# EAGLE design template (EAGLE 8.5.0)
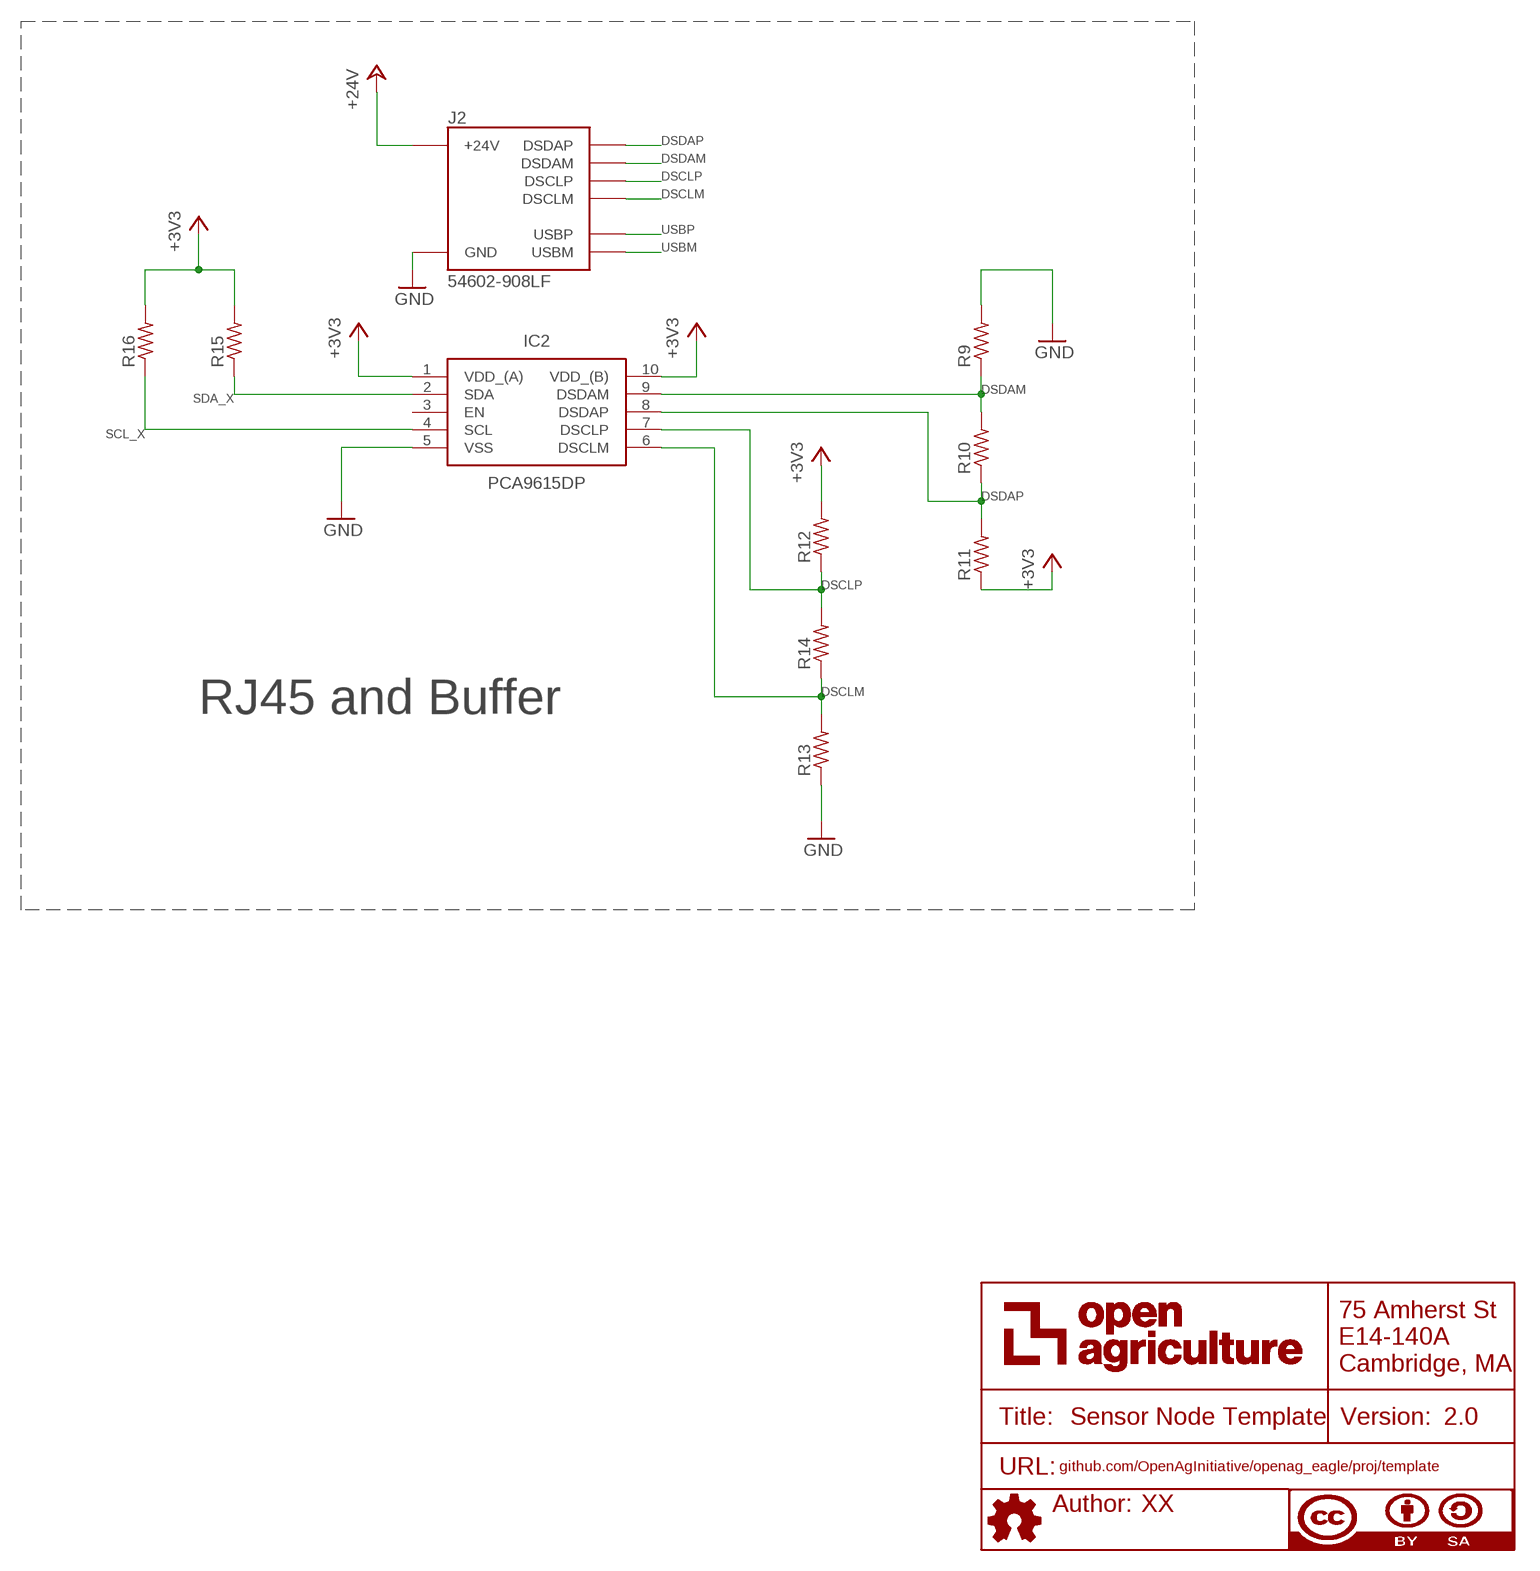
[diagram p0: schematic, sheet 1]

## Parts
FRAME1  DOCFIELD  [DOCFIELD]
IC2  PCA9615DP  [SOP50P490X110-10N]
J2  54602-908LF  OPENAG-V1-RJ45PTH  [OPENAG-V1-RJ45]
R9  R-US_R0603  [R0603]
R10  R-US_R0603  [R0603]
R11  R-US_R0603  [R0603]
R12  R-US_R0603  [R0603]
R13  R-US_R0603  [R0603]
R14  R-US_R0603  [R0603]
R15  R-US_R0603  [R0603]
R16  R-US_R0603  [R0603]

## Nets
+3V3: IC2.1(VDD_(A)) IC2.10(VDD_(B)) R11.1 R12.2 R15.2 R16.2
+24V: J2.24V(6)(+24V)
DSCLM: IC2.6(DSCLM) J2.DSCLM(5)(DSCLM) R13.2 R14.1
DSCLP: IC2.7(DSCLP) J2.DSCLP(4)(DSCLP) R12.1 R14.2
DSDAM: IC2.9(DSDAM) J2.DSDAM(2)(DSDAM) R9.1 R10.2
DSDAP: IC2.8(DSDAP) J2.DSDAP(1)(DSDAP) R10.1 R11.2
GND: IC2.5(VSS) J2.GND(3)(GND) R9.2 R13.1
SCL_X: IC2.4(SCL) R16.1
SDA_X: IC2.2(SDA) R15.1
USBM: J2.USBM(8)(USBM)
USBP: J2.USBP(7)(USBP)
Unconnected: IC2.3(EN)

## Notes on the sheet
- RJ45 and Buffer

## Library data of the parts
FRAME1 = openag-frames:DOCFIELD: DOCUMENT FIELD; AUTHOR: XX; DESCRIPTION: Sensor Node Template; TITLE: Sensor Node Template; URL: github.com/OpenAgInitiative/openag_eagle/proj/template; VER: 2.0
IC2 = PCA9615DP:PCA9615DP: Buffer, ReDriver 2 Channel 400kHz 10-TSSOP Source: Datasheet <http://www.nxp.com/docs/en/data-sheet/PCA9615.pdf>; DESCRIPTION: Buffer, ReDriver 2 Channel 400kHz 10-TSSOP; HEIGHT: 1.1mm; MANUFACTURER_NAME: Nexperia; MANUFACTURER_PART_NUMBER: PCA9615DP; SUPPLIER_NAME: RS
J2 = openag_connector:OPENAG-V1-RJ45: Amphenol FCI - 54602-908LF - CONN MOD JACK 8P8C R/A UNSHLD Description: Jack Modular Connector 8p8c (RJ45, Ethernet) 90� Angle (Right) Unshielded Cat3 Technical Specifications: Connector Type: Jack Number of Positions/Contacts: 8p8c (RJ45, Ethernet) Number of Ports: 1 Number of Rows: 1 Mounting Type: Through Hole Orientation: 90� Angle (Right) Termination: Solder Shielding: Unshielded Ratings: Cat3 Features: Board Lock LED Color: Does Not Contain LED Tab Direction: Down Contact Material: Copper Alloy Contact Finish: Gold Contact Finish Thickness: 15�in (0.38�m) Housing Material: Polyester, Glass Filled Operating Temperature: -40�C ~ 70�C Datasheet(s): 54601-x04(zzz)WPLF Drawing <http://cdn.amphenol-icc.com/media/wysiwyg/files/drawing/c-bmj-0102.pdf> Vendor(s): Digikey: 609-1046-ND <https://www.digikey.com/product-detail/en/amphenol-fci/54602-908LF/609-1046-ND/1001360>; POPULATE: YES; VERIFIED: NO
R9-R16 = rcl:R-US_: RESISTOR, American symbol; SPICEPREFIX: R

## Board
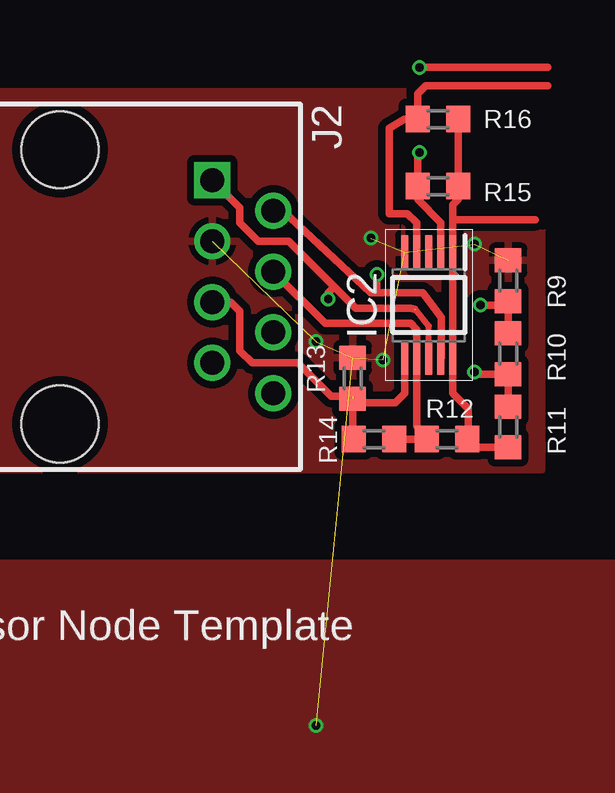
[diagram p1: board, top side]
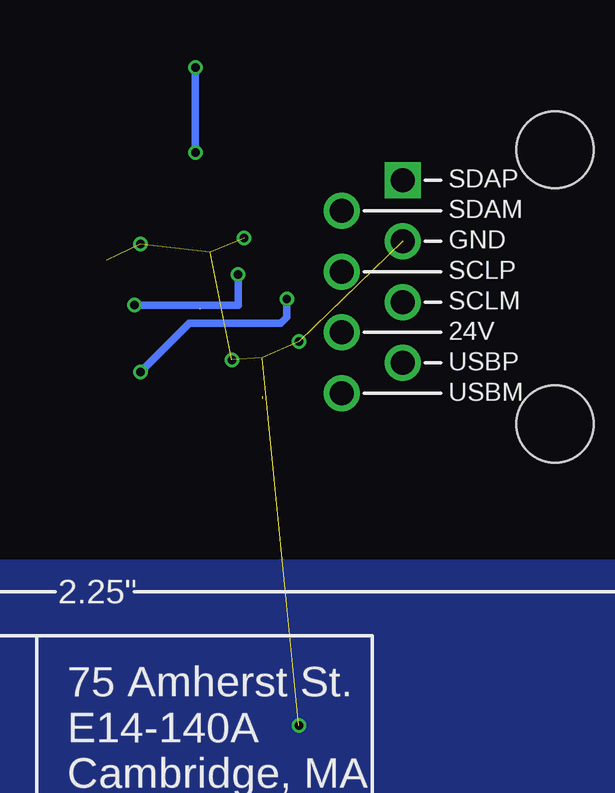
[diagram p2: board, bottom side, seen from below]

No outline drawn. Coordinates in mm, seen from the top.
Copper layers (1*16): Top 0.035559375mm / dielectric 1.6mm / Bottom 0.035559375mm
Design rules "oshpark-2layer *": minimum track width 6mil, minimum drill 10mil, track to track 6mil, track to pad 6mil, pad to pad 6mil, via to via 6mil, smd to smd 6mil, copper to edge 15mil, drill to drill 6mil, minimum pad ring 5mil, minimum via ring 5mil, stop-mask expansion 2.5mil, vias tented up to drill 20mil, thermal gap 10mil
Holes 0 mm at 3.17,3.17 3.17,22.23 60.33,22.23 60.33,3.17
tRestrict: area 1.5,20.6 to 4.8,23.9; area 1.5,1.5 to 4.8,4.8; area 58.7,20.6 to 62,23.9; area 58.7,1.5 to 62,4.8
bRestrict: area 1.5,20.6 to 4.8,23.9; area 1.5,1.5 to 4.8,4.8; area 58.7,20.6 to 62,23.9; area 58.7,1.5 to 62,4.8

### Footprints (pad centres in the part's own frame; a part is rotated, then mirrored left to right if it is on the bottom)
SOP50P490X110-10N = smd 1.4 x 0.3: 1 -2.2,1; 2 -2.2,0.5; 3 -2.2,0; 4 -2.2,-0.5; 5 -2.2,-1; 6 2.2,-1; 7 2.2,-0.5; 8 2.2,0; 9 2.2,0.5; 10 2.2,1
OPENAG-V1-RJ45 = drill 1: 24V(6) 1.905,8.89; DSCLM(5) 0.635,6.35; DSCLP(4) -0.635,8.89; DSDAM(2) -3.175,8.89; GND(3) -1.905,6.35; USBM(8) 4.445,8.89; USBP(7) 3.175,6.35 | drill 1 square: DSDAP(1) -4.445,6.35 | hole 3.2: -5.715,0; 5.715,0
R0603 = smd 1 x 1.1: 1 -0.85,0; 2 0.85,0

### Placement (x,y rotation side)
FRAME1  58.42,3.17 0 bottom
IC2  28.07,36.07 270 top
J2  12.7,36.83 270 top
R9  31.37,37.08 90 top
R10  31.37,34.04 90 top
R11  31.37,30.99 90 top
R12  28.83,30.48 0 top
R13  24.89,33.02 270 top
R14  25.78,30.48 0 top
R15  28.45,41.02 0 top
R16  28.45,43.81 0 top
U$1  [OPENAG-LOGO-750-MIL]  38.1,1.02 0 top

### Tracks (layer width: path | path; a pad name or v marks a point on that pad's centre or on a via)
+3V3
  Top 0.305: R11.1 30.02,30.14 R12.2 29.72,30.52 29.72,31.75 29.07,32.4 IC2.10 IC2.1 29.07,39.62 | 29.07,39.62 29.07,40.24 29.3,40.47 R15.2 R16.2 | 29.07,39.62 32.51,39.62
DSCLM  (1 unrouted)
  Top 0.305: R14.1 24.89,30.52 24.89,32 | 24.89,32 R13.2 | IC2.6 27.07,32.4 26.67,32 24.89,32 | 24.89,32.26 24,32.26 22.61,33.66 20.7,33.66 20.19,34.16 20.19,35.81 19.81,36.2 J2.DSCLM(5)
DSCLP
  Top 0.305: R14.2 R12.1 27.56,31.03 27.56,31.5 27.57,31.63 IC2.7 27.57,35.04 27.3,35.31 23.75,35.31 J2.DSCLP(4)
DSDAM  (via drill 0.35)
  Top 0.305: J2.DSDAM(2) 21.97,40.01 25.65,36.58 25.91,36.58 | IC2.9 28.57,35.56 27.81,36.58 25.91,36.58 | R10.2 R9.1 arc-90 31.2,36.07 v30.23,36.07 30.1,36.07 | v25.91,37.34 25.91,36.58
  Bottom 0.305: v30.23,36.07 25.91,36.07 v25.91,37.34
DSDAP  (via drill 0.35)  (1 unrouted)
  Top 0.254: IC2.8 28.07,35.19 27.49,35.89
  Top 0.305: R11.2 R10.1 30.06,33.19 v29.97,33.27 | 27.48,35.89 27.3,35.94 25.02,35.94 24.13,36.83 | 24.13,36.83 22.23,38.73 20.95,38.73 20.19,39.5 20.19,40.13 J2.DSDAP(1) | v23.88,36.32 23.88,36.58 24.13,36.83
  Bottom 0.305: v29.97,33.27 27.94,35.31 24.13,35.31 23.88,35.56 v23.88,36.32
GND  (via drill 0.35)  (8 unrouted)
  other vias: 23.37,18.54 25.65,38.86 29.97,38.61 26.16,33.78 23.37,34.54
  pour Top (isolate 0.406): 0,25.4 63.5,25.4 63.5,0 0,0
  pour Bottom (isolate 0.406): 63.5,25.4 63.5,0 0,0 0,25.4
  pour Top (isolate 0.305): 2.54,29.21 32.77,29.21 32.77,44.96 2.54,44.96
SCL_X
  Top 0.305: IC2.4 27.57,39.49 27.18,39.88 26.42,39.88 26.42,43.43 27.05,43.81 R16.1 27.6,44.87 27.94,45.21 29.72,45.21 29.97,45.21 33.02,45.21
SDA_X  (via drill 0.35)
  Top 0.305: IC2.2 28.57,39.51 27.6,40.47 R15.1 27.6,42.33 v27.69,42.42 | v27.69,45.97 33.02,45.97
  Bottom 0.305: v27.69,42.42 v27.69,45.97

### Text on the board
tPlace: Sensor Node Template | I2C Addr: 0x??
bPlace: 2.25" | 0.125" | d=0.15" | 0.75" | 0.125"